# EAGLE schematic PowerSupp (EAGLE 7.1.0)
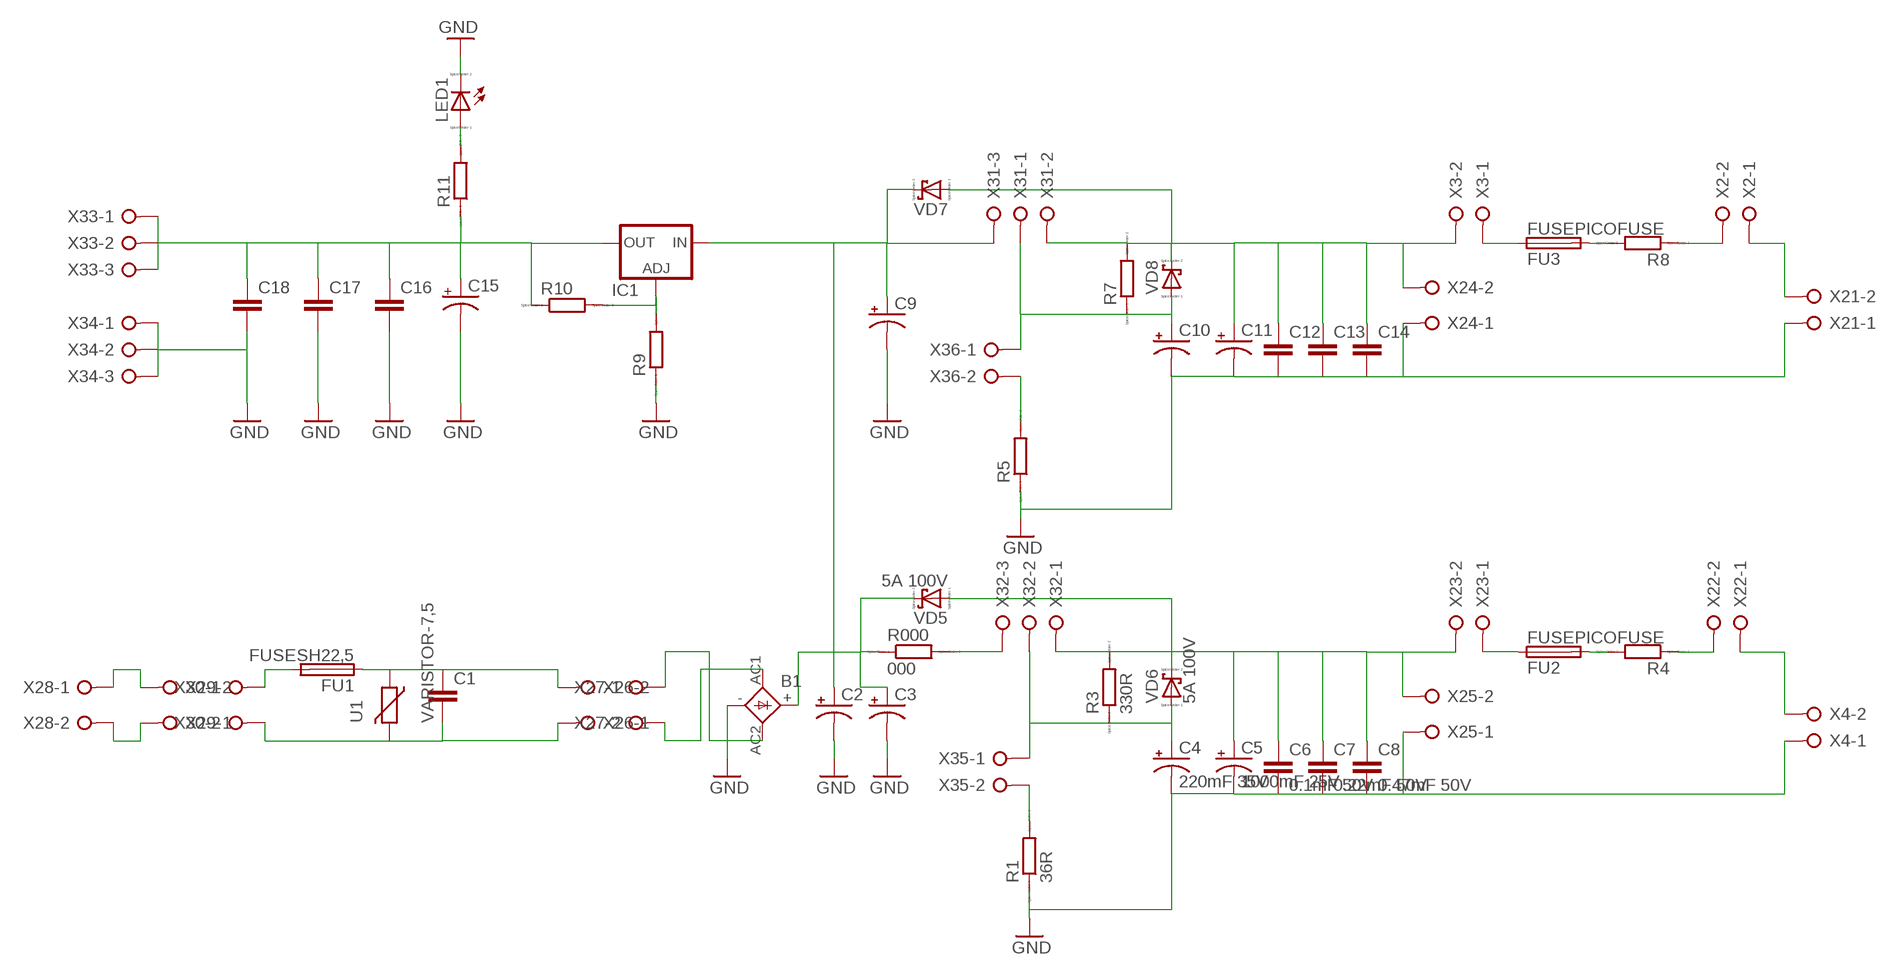
[diagram p0: schematic, sheet 1]

## Parts
B1  KBU  [KBU]
C1  C15/8  [C15B8]
C2  CPOL-USE7.5-16  [E7,5-16]
C3  CPOL-USE7.5-16  [E7,5-16]
C4  220mF 35V  CPOL-USE5-10.5  [E5-10,5]
C5  1000mF 25V  CPOL-USE5-13  [E5-13]
C6  0.1mF 50V  C-EU050-045X075  [C050-045X075]
C7  0.22mF 50V  C-EU050-045X075  [C050-045X075]
C8  0.47mF 50V  C-EU050-045X075  [C050-045X075]
C9  CPOL-USE7.5-16  [E7,5-16]
C10  CPOL-USE5-10.5  [E5-10,5]
C11  CPOL-USE5-13  [E5-13]
C12  C-EU050-045X075  [C050-045X075]
C13  C-EU050-045X075  [C050-045X075]
C14  C-EU050-045X075  [C050-045X075]
C15  CPOL-USE5-10.5  [E5-10,5]
C16  C-EU050-045X075  [C050-045X075]
C17  C-EU050-045X075  [C050-045X075]
C18  C-EU050-045X075  [C050-045X075]
FU1  FUSESH22,5  [SH22,5]
FU2  FUSEPICOFUSE  [PICOFUSE]
FU3  FUSEPICOFUSE  [PICOFUSE]
IC1  LM317TL  [317TL]
LED1  LED_ELD260  [LED_LD260]
R000  000  R0207/10  [0207/10]
R1  36R  R0207/10  [0207/10]
R3  330R  R0207/10  [0207/10]
R4  R0207/10  [0207/10]
R5  R0207/10  [0207/10]
R7  R0207/10  [0207/10]
R8  R0207/10  [0207/10]
R9  R0207/10  [0207/10]
R10  R0207/10  [0207/10]
R11  R0207/10  [0207/10]
U1  VARISTOR-7,5  [R-7,5]
VD5  5A 100V  SCHOTTKY-DIODEF126Z12  [DIODE_F126Z12]
VD6  5A 100V  SCHOTTKY-DIODEF126Z12  [DIODE_F126Z12]
VD7  SCHOTTKY-DIODEF126Z12  [DIODE_F126Z12]
VD8  SCHOTTKY-DIODEF126Z12  [DIODE_F126Z12]
X2  W237-02P  [W237-132]
X3  W237-02P  [W237-132]
X4  W237-02P  [W237-132]
X21  W237-02P  [W237-132]
X22  W237-02P  [W237-132]
X23  W237-02P  [W237-132]
X24  W237-02P  [W237-132]
X25  W237-02P  [W237-132]
X26  W237-02P  [W237-132]
X27  W237-02P  [W237-132]
X28  W237-02P  [W237-132]
X29  W237-02P  [W237-132]
X30  W237-02P  [W237-132]
X31  W237-3E  [W237-3E]
X32  W237-3E  [W237-3E]
X33  W237-3E  [W237-3E]
X34  W237-3E  [W237-3E]
X35  W237-02P  [W237-132]
X36  W237-02P  [W237-132]

## Nets
GND: B1.- C2.- C3.- C4.- C5.- C6.2 C7.2 C8.2 C9.- C10.- C11.- C12.2 C13.2 C14.2 C15.- C16.2 C17.2 C18.2 LED1.K(C) R1.1 R5.1 R9.1 X4.1 X21.1 X24.1 X25.1 X34.1 X34.2 X34.3
N$1: FU1.2 X30.1
N$2: C1.1 FU1.1 U1.1 X26.2
N$3: C1.2 U1.2 X26.1 X30.2
N$4: X28.1 X29.2
N$5: X28.2 X29.1
N$6: B1.AC2 X27.1
N$7: B1.AC1 X27.2
N$8: R8.1 X2.2
N$9: R000.2 X32.3
N$10: C10.+ R7.1 VD8.A(C) X31.1 X36.1
N$11: C11.+ C12.1 C13.1 C14.1 R7.2 VD7.A(C) VD8.C(A) X3.2 X24.2 X31.2
N$12: R5.2 X36.2
N$13: C4.+ R3.1 VD6.A(C) X32.2 X35.1
N$14: C5.+ C6.1 C7.1 C8.1 R3.2 VD5.A(C) VD6.C(A) X23.2 X25.2 X32.1
N$15: R1.2 X35.2
N$16: FU3.1 X3.1
N$17: FU2.2 R4.2
N$18: FU3.2 R8.2
N$20: IC1.1(ADJ) R9.2 R10.2
N$21: R4.1 X22.2
N$22: B1.+ C2.+ C3.+ C9.+ IC1.3(IN) R000.1 VD5.C(A) VD7.C(A) X31.3
N$23: LED1.A R11.2
N$24: FU2.1 X23.1
N$25: X2.1 X21.2
N$26: X4.2 X22.1
N$27: C15.+ C16.1 C17.1 C18.1 IC1.2(OUT) R10.1 R11.1 X33.1 X33.2 X33.3

## Library data of the parts
B1 = rectifier:KBU: DIOTEC RECTIFIER
C1 = capacitor-wima:C: CAPACITOR naming: grid - package width
C2-C5 C9-C11 C15 = rcl:CPOL-US: POLARIZED CAPACITOR, American symbol
C6-C8 C12-C14 C16-C18 = rcl:C-EU: CAPACITOR, European symbol
FU1-FU3 = fuse:FUSE: Fuse; OC_FARNELL: unknown; OC_NEWARK: unknown
IC1 = v-reg:LM317TL: VOLTAGE REGULATOR
LED1 = eagle-ltspice:LED_E: LED Source: http://www.osram.convergy.de Source: www.luxeon.com Source: www.kingbright.com; SPICEMODEL: NONE; SPICEPREFIX: D; SPICETYPE: diode
R000 R1 R3-R5 R7-R11 = eagle-ltspice:R: RESISTOR, European symbol; SPICEMODEL: NONE; SPICEPREFIX: R
U1 = varistor:VARISTOR: VARISTOR
VD5-VD8 = eagle-ltspice:SCHOTTKY-DIODE: Schottky Diode; SPICEMODEL: NONE; SPICEPREFIX: D; SPICETYPE: diode
X2-X4 X21-X30 X35 X36 = con-wago-508:W237-02P: WAGO SREW CLAMP; OC_FARNELL: unknown; OC_NEWARK: unknown
X31-X34 = con-wago-508:W237-3E: WAGO SREW CLAMP; OC_FARNELL: unknown; OC_NEWARK: unknown